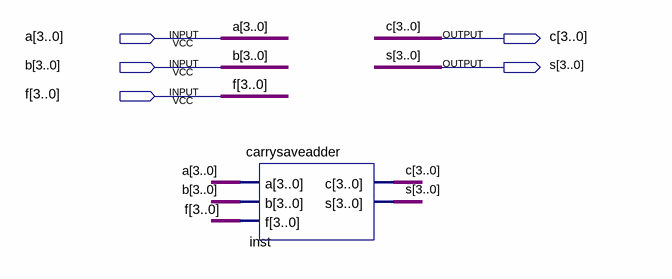
[diagram p0: schematic sheet]
// Quartus schematic carrysaveadder_test.bdf as structural Verilog: 1 symbols, 5 pins
module carrysaveadder_test (
  input  [3:0] a,
  input  [3:0] b,
  input  [3:0] f,
  output [3:0] c,
  output [3:0] s
);

  carrysaveadder inst (.a(a), .b(b), .f(f), .c(c), .s(s));
endmodule
